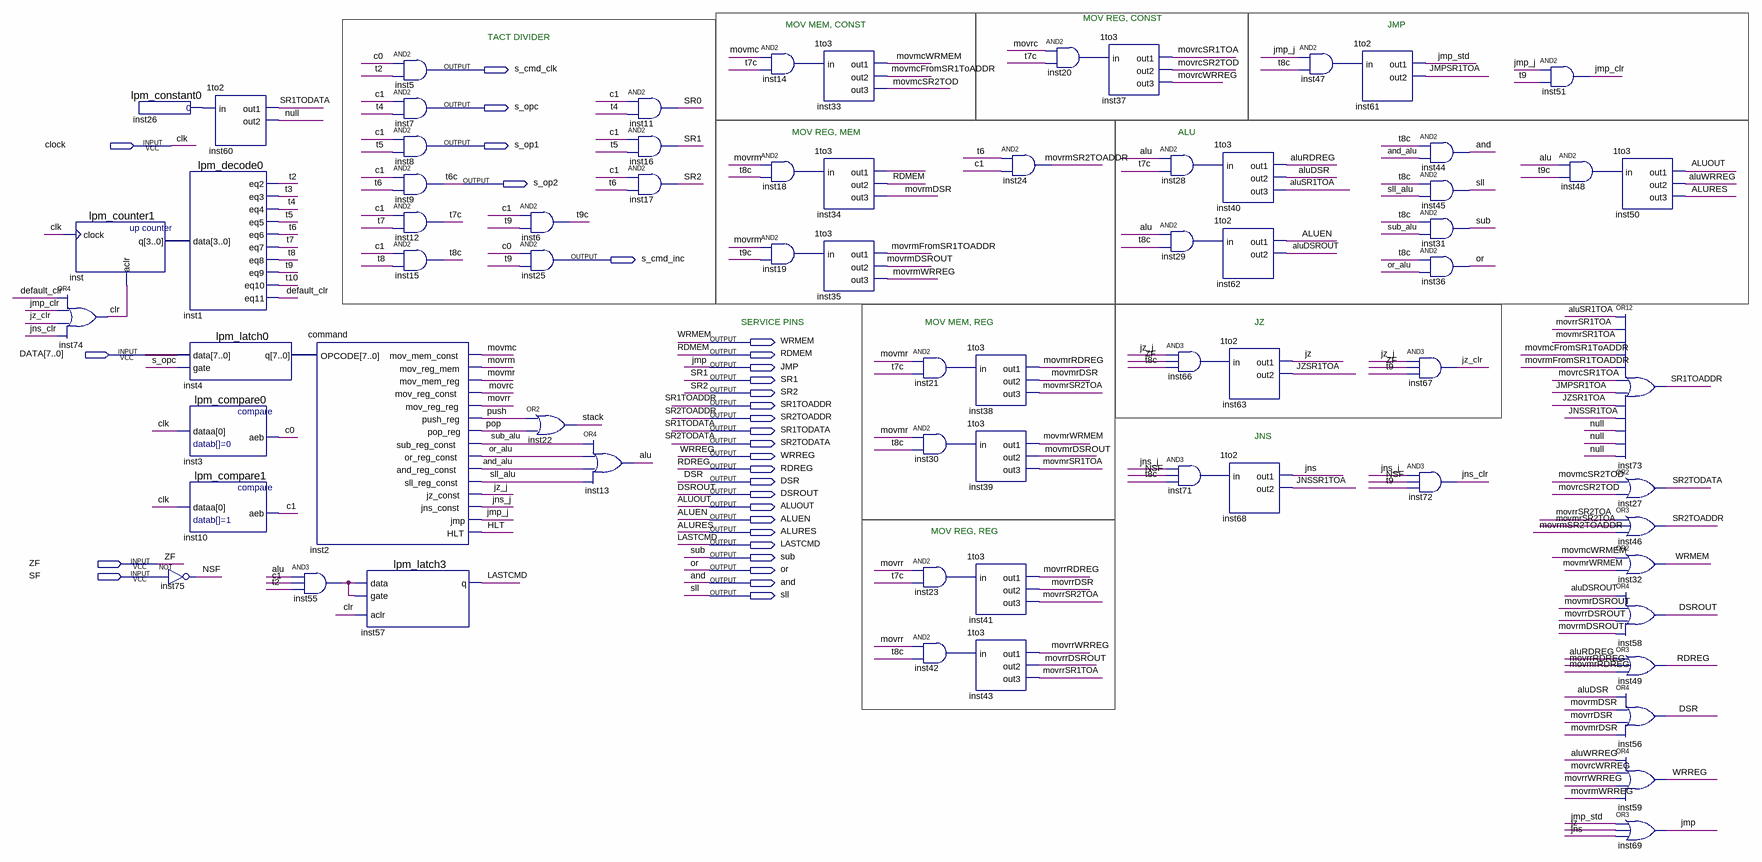
[diagram p0: schematic sheet]
// Quartus schematic ControlUnit.bdf as structural Verilog: 70 symbols, 30 pins
module ControlUnit (
  input  clock,
  input  [7:0] DATA,
  input  ZF,
  input  SF,
  output s_cmd_clk,
  output s_opc,
  output s_op1,
  output s_op2,
  output s_cmd_inc,
  output WRMEM,
  output RDMEM,
  output JMP,
  output SR1,
  output SR2,
  output SR1TOADDR,
  output SR2TOADDR,
  output SR1TODATA,
  output SR2TODATA,
  output WRREG,
  output RDREG,
  output DSR,
  output DSROUT,
  output ALUOUT,
  output ALUEN,
  output ALURES,
  output LASTCMD,
  output sub,
  output \or ,
  output \and ,
  output sll
);

  wire alu, aluDSR, aluDSROUT, aluRDREG, aluSR1TOA, aluWRREG, and_alu, c0, c1, clr, default_clr, HLT,
       inst14_out, inst18_out, inst19_out, inst20_out, inst21_out, inst23_out, inst26_result, inst28_out,
       inst29_out, inst30_out, inst34_out1, inst42_out, inst47_out, inst48_out, inst55_out, inst66_out,
       inst71_out, jmp_clr, jmp_j, jmp_std, JMPSR1TOA, jns, jns_clr, jns_j, JNSSR1TOA, jz, jz_clr, jz_j,
       JZSR1TOA, movmc, movmcFromSR1ToADDR, movmcSR2TOD, movmcWRMEM, movmr, movmrDSR, movmrDSROUT,
       movmrRDREG, movmrSR1TOA, movmrSR2TOA, movmrWRMEM, movrc, movrcSR1TOA, movrcSR2TOD, movrcWRREG, movrm,
       movrmDSR, movrmDSROUT, movrmFromSR1TOADDR, movrmSR2TOADDR, movrmWRREG, movrr, movrrDSR, movrrDSROUT,
       movrrRDREG, movrrSR1TOA, movrrSR2TOA, movrrWRREG, NSF, \null , or_alu, pop, push, sll_alu, SR0, stack,
       sub_alu, t2, t3, t4, t5, t6, t7, t7c, t8, t8c, t9, t9c, t10;
  wire [3:0] inst_q;
  wire [7:0] inst4_q;

  lpm_counter1 inst (.clock(clock), .aclr(clr), .q(inst_q));
  or inst74 (clr, default_clr, jmp_clr, jz_clr, jns_clr);
  lpm_constant0 inst26 (.result(inst26_result));
  not inst75 (NSF, SF);
  \1to2  inst60 (.in(inst26_result), .out1(SR1TODATA), .out2(\null ));
  lpm_decode0 inst1 (
    .data(inst_q), .eq2(t2), .eq3(t3), .eq4(t4), .eq5(t5), .eq6(t6), .eq7(t7), .eq8(t8), .eq9(t9),
    .eq10(t10), .eq11(default_clr));
  lpm_latch0 inst4 (.data(DATA), .gate(s_opc), .q(inst4_q));
  lpm_compare0 inst3 (.dataa(clock), .aeb(c0));
  lpm_compare1 inst10 (.dataa(clock), .aeb(c1));
  command inst2 (
    .OPCODE(inst4_q), .mov_mem_const(movmc), .mov_reg_mem(movrm), .mov_mem_reg(movmr), .mov_reg_const(movrc),
    .mov_reg_reg(movrr), .push_reg(push), .pop_reg(pop), .sub_reg_const(sub_alu), .or_reg_const(or_alu),
    .and_reg_const(and_alu), .sll_reg_const(sll_alu), .jz_const(jz_j), .jns_const(jns_j), .jmp(jmp_j),
    .HLT(HLT));
  and inst55 (inst55_out, alu, c1, t2);
  lpm_latch3 inst57 (.data(inst55_out), .gate(inst55_out), .aclr(clr), .q(LASTCMD));
  and inst5 (s_cmd_clk, c0, t2);
  and inst7 (s_opc, c1, t4);
  and inst8 (s_op1, c1, t5);
  and inst9 (s_op2, c1, t6);
  and inst12 (t7c, c1, t7);
  and inst15 (t8c, c1, t8);
  and inst6 (t9c, c1, t9);
  and inst25 (s_cmd_inc, c0, t9);
  or inst22 (stack, push, pop);
  and inst11 (SR0, c1, t4);
  and inst16 (SR1, c1, t5);
  and inst17 (SR2, c1, t6);
  or inst13 (alu, sub_alu, or_alu, and_alu, sll_alu);
  and inst14 (inst14_out, movmc, t7c);
  and inst18 (inst18_out, movrm, t8c);
  and inst19 (inst19_out, movrm, t9c);
  \1to3  inst33 (.in(inst14_out), .out1(movmcWRMEM), .out2(movmcFromSR1ToADDR), .out3(movmcSR2TOD));
  \1to3  inst34 (.in(inst18_out), .out1(inst34_out1), .out2(RDMEM), .out3(movrmDSR));
  \1to3  inst35 (.in(inst19_out), .out1(movrmFromSR1TOADDR), .out2(movrmDSROUT), .out3(movrmWRREG));
  and inst21 (inst21_out, movmr, t7c);
  and inst30 (inst30_out, movmr, t8c);
  and inst23 (inst23_out, movrr, t7c);
  and inst42 (inst42_out, movrr, t8c);
  \1to3  inst38 (.in(inst21_out), .out1(movmrRDREG), .out2(movmrDSR), .out3(movmrSR2TOA));
  \1to3  inst39 (.in(inst30_out), .out1(movmrWRMEM), .out2(movmrDSROUT), .out3(movmrSR1TOA));
  \1to3  inst41 (.in(inst23_out), .out1(movrrRDREG), .out2(movrrDSR), .out3(movrrSR2TOA));
  \1to3  inst43 (.in(inst42_out), .out1(movrrWRREG), .out2(movrrDSROUT), .out3(movrrSR1TOA));
  and inst24 (movrmSR2TOADDR, t6, c1);
  and inst20 (inst20_out, movrc, t7c);
  \1to3  inst37 (.in(inst20_out), .out1(movrcSR1TOA), .out2(movrcSR2TOD), .out3(movrcWRREG));
  and inst28 (inst28_out, alu, t7c);
  and inst29 (inst29_out, alu, t8c);
  and inst66 (inst66_out, jz_j, ZF, t8c);
  and inst71 (inst71_out, jns_j, NSF, t8c);
  \1to3  inst40 (.in(inst28_out), .out1(aluRDREG), .out2(aluDSR), .out3(aluSR1TOA));
  \1to2  inst62 (.in(inst29_out), .out1(ALUEN), .out2(aluDSROUT));
  \1to2  inst63 (.in(inst66_out), .out1(jz), .out2(JZSR1TOA));
  \1to2  inst68 (.in(inst71_out), .out1(jns), .out2(JNSSR1TOA));
  and inst47 (inst47_out, jmp_j, t8c);
  \1to2  inst61 (.in(inst47_out), .out1(jmp_std), .out2(JMPSR1TOA));
  and inst44 (\and , t8c, and_alu);
  and inst45 (sll, t8c, sll_alu);
  and inst31 (sub, t8c, sub_alu);
  and inst36 (\or , t8c, or_alu);
  and inst67 (jz_clr, jz_j, ZF, t9);
  and inst72 (jns_clr, jns_j, NSF, t9);
  and inst51 (jmp_clr, jmp_j, t9);
  and inst48 (inst48_out, alu, t9c);
  \1to3  inst50 (.in(inst48_out), .out1(ALUOUT), .out2(aluWRREG), .out3(ALURES));
  or inst73 (SR1TOADDR, aluSR1TOA, movrrSR1TOA, movmrSR1TOA, movmcFromSR1ToADDR, movrmFromSR1TOADDR, movrcSR1TOA, JMPSR1TOA, JZSR1TOA, JNSSR1TOA, \null , \null , \null );
  or inst27 (SR2TODATA, movmcSR2TOD, movrcSR2TOD);
  or inst46 (SR2TOADDR, movrrSR2TOA, movmrSR2TOA, movrmSR2TOADDR);
  or inst32 (WRMEM, movmcWRMEM, movmrWRMEM);
  or inst58 (DSROUT, aluDSROUT, movmrDSROUT, movrrDSROUT, movrmDSROUT);
  or inst49 (RDREG, aluRDREG, movrrRDREG, movmrRDREG);
  or inst56 (DSR, aluDSR, movrmDSR, movrrDSR, movmrDSR);
  or inst59 (WRREG, aluWRREG, movrcWRREG, movrrWRREG, movrmWRREG);
  or inst69 (JMP, jmp_std, jz, jns);

  // Other names for the same wires on the sheet: clk = clock; t6c = s_op2

  // Notes on the sheet:
  //   MOV REG, CONST
  //   MOV MEM, CONST
  //   JMP
  //   TACT DIVIDER
  //   MOV REG, MEM
  //   ALU
  //   SERVICE PINS
  //   MOV MEM, REG
  //   JZ
  //   JNS
  //   MOV REG, REG
endmodule
